# Altium schematic sheet BatteryStackMonitor.SchDoc: Battery stack monitor
size A3; SheetNumber: 2; SheetTotal: 7
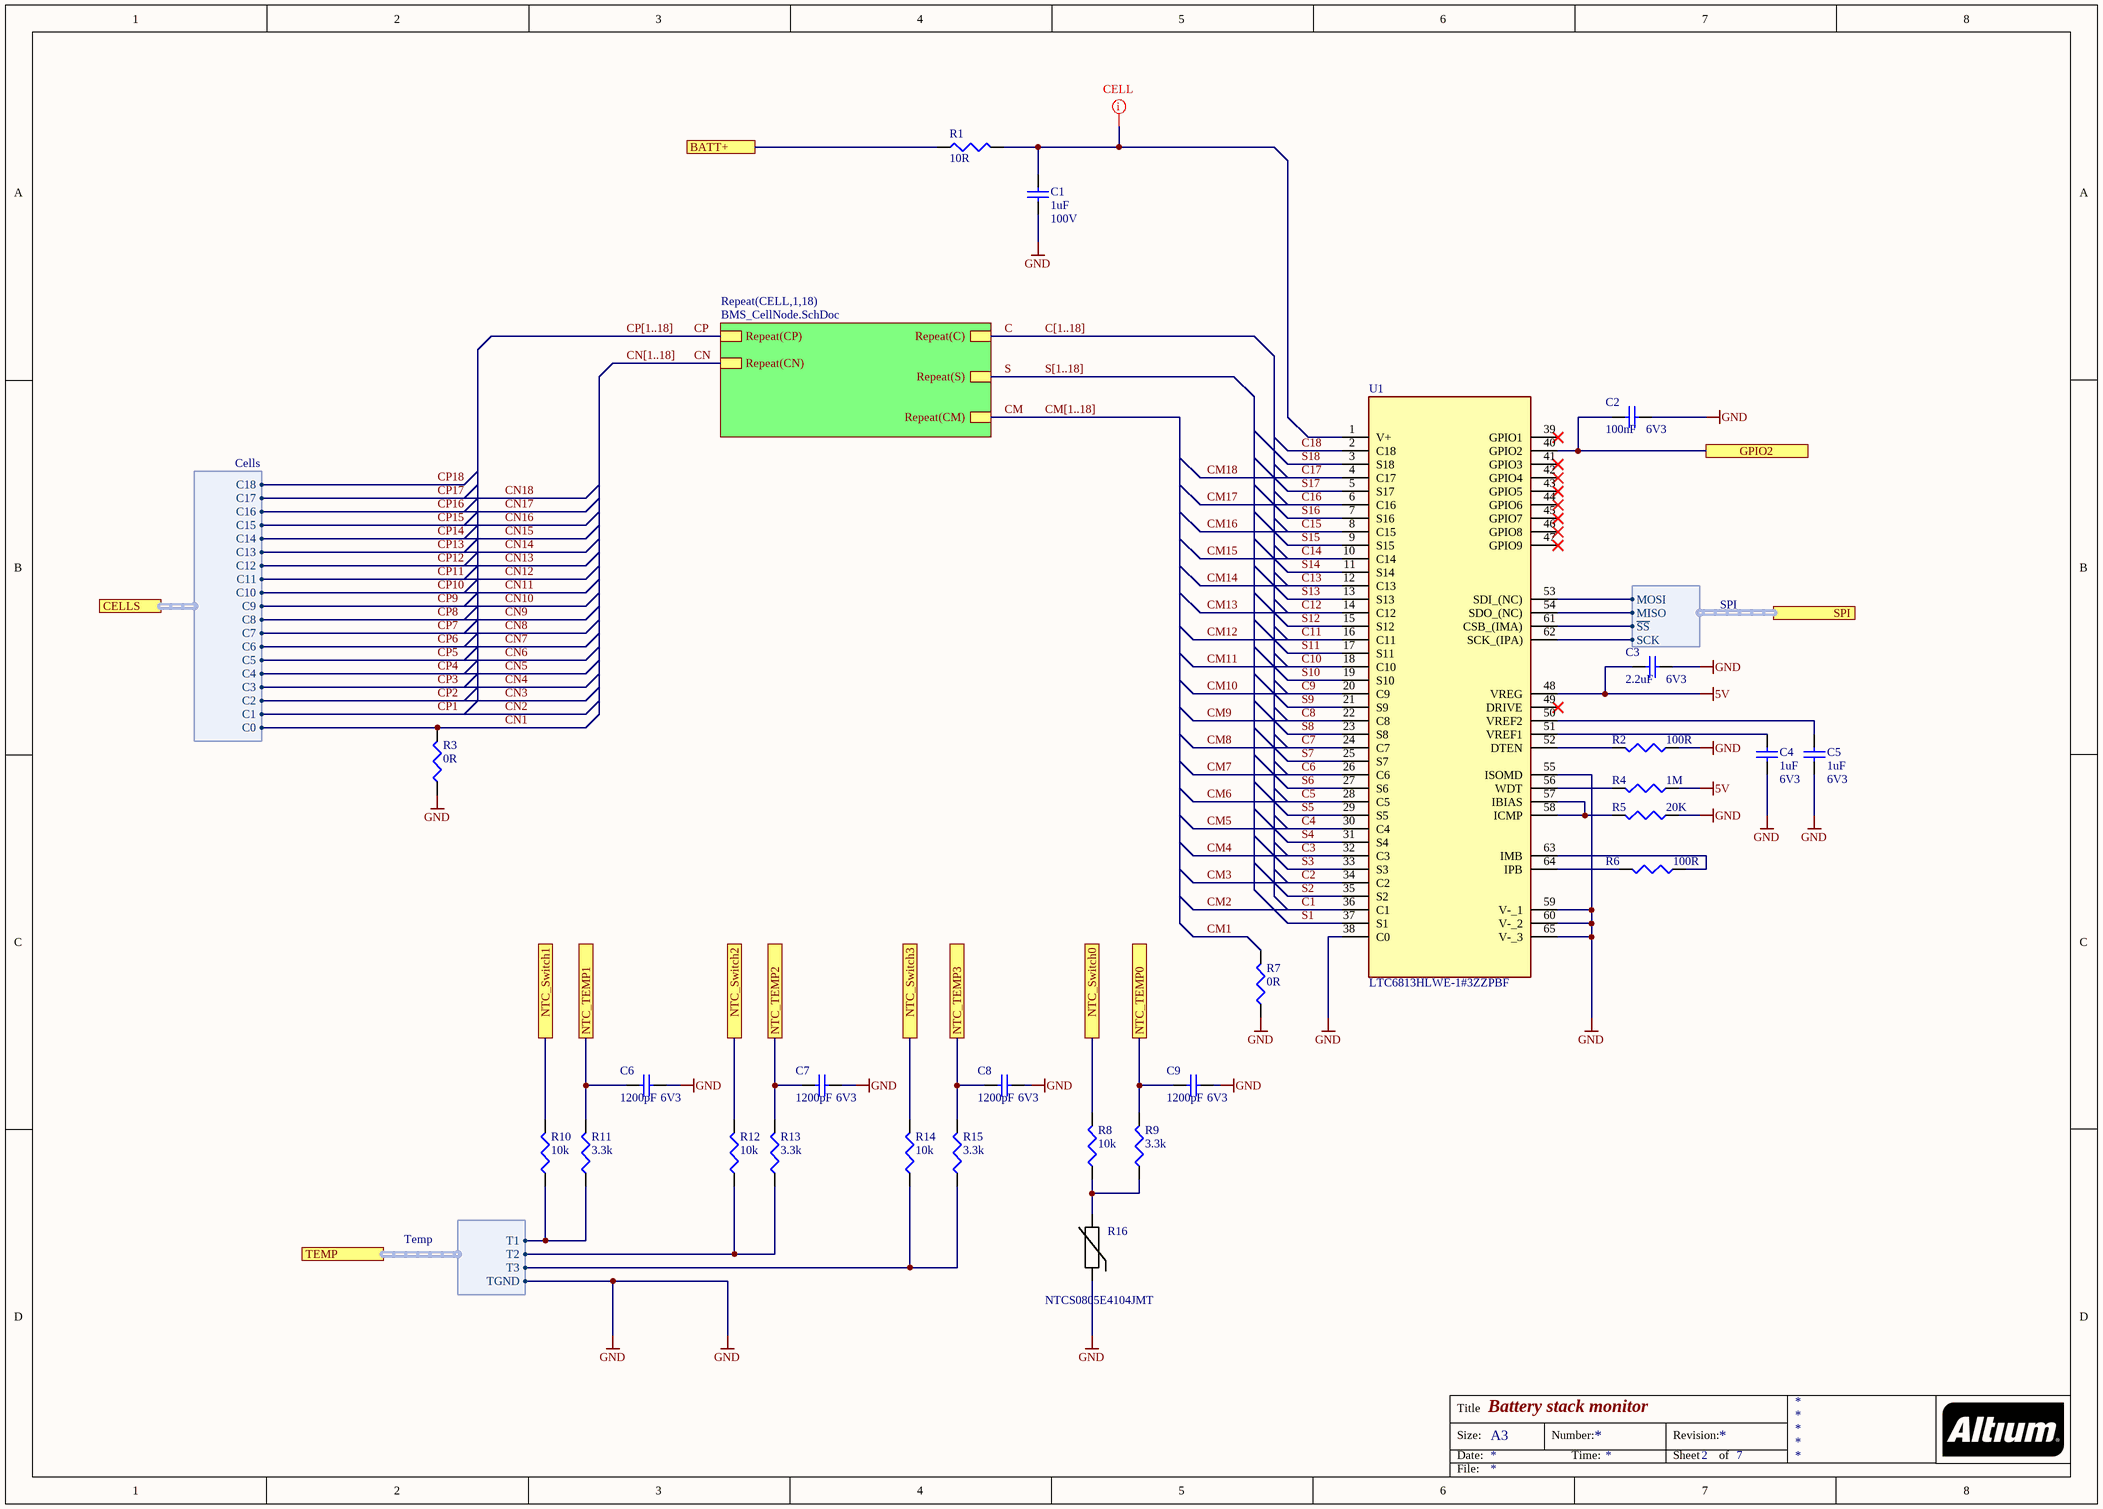
[diagram p0: BatteryStackMonitor.SchDoc]

## Parts
C1  1uF  Voltage Rating: 100V  [C-1206]
C2  100nF  Voltage Rating: 6V3  [C0402]
C3  2.2uF  Voltage Rating: 6V3  [C0402]
C4  1uF  Voltage Rating: 6V3  [C0402]
C5  1uF  Voltage Rating: 6V3  [C0402]
C6  1200pF  Voltage Rating: 6V3  [C0402]
C7  1200pF  Voltage Rating: 6V3  [C0402]
C8  1200pF  Voltage Rating: 6V3  [C0402]
C9  1200pF  Voltage Rating: 6V3  [C0402]
R1  10R  [R1206]
R2  100R  [0402]
R3  0R  [0603]
R4  1M  [0402]
R5  20K  [0402]
R6  100R  [0402]
R7  0R  [0603]
R8  10k  [0402]
R9  3.3k  [0402]
R10  10k  [0402]
R11  3.3k  [0402]
R12  10k  [0402]
R13  3.3k  [0402]
R14  10k  [0402]
R15  3.3k  [0402]
R16  NTCS0805E4104JMT  [0603]
U1  LTC6813HLWE-1#3ZZPBF  [QFP50P1200X1200X160-65N]

## Sub-sheets
Repeat(CELL,1,18) = BMS_CellNode.SchDoc: Repeat(CN), Repeat(CP), Repeat(S), Repeat(C), Repeat(CM)

## Ports
BATT+, CELLS (harness Cells), GPIO2, NTC_Switch0, NTC_Switch1, NTC_Switch2, NTC_Switch3, NTC_TEMP0, NTC_TEMP1, NTC_TEMP2, NTC_TEMP3, SPI (harness SPI), TEMP (harness Temp)

## Harnesses
SPI: ~{SS}, SCK, MISO, MOSI
Cells: C1, C9, C2, C3, C4, C5, C6, C7, C8, C10, C11, C0, C12, C13, C14, C15, C16, C17, C18
Temp: T1, T2, TGND, T3

## Nets
5V: C3.1 R4.1 U1.48(VREG)
GND: C1.1 C2.2 C3.2 C4.2 C5.2 C6.2 C7.2 C8.2 C9.2 R2.1 R3.1 R5.1 R7.1 R16.1 U1.38(C0) U1.55(ISOMD) U1.59(V-_1) U1.60(V-_2) U1.65(V-_3) ; port TEMP.TGND
BATT+: R1.1 ; port BATT+
C: sheet Repeat(CELL,1,18)/Repeat(C)
C1: U1.36(C1)  [also labelled CM2]
C2: U1.34(C2)  [also labelled CM3]
C3: U1.32(C3)  [also labelled CM4]
C4: U1.30(C4)  [also labelled CM5]
C5: U1.28(C5)  [also labelled CM6]
C6: U1.26(C6)  [also labelled CM7]
C7: U1.24(C7)  [also labelled CM8]
C8: U1.22(C8)  [also labelled CM9]
C9: U1.20(C9)  [also labelled CM10]
C10: U1.18(C10)  [also labelled CM11]
C11: U1.16(C11)  [also labelled CM12]
C12: U1.14(C12)  [also labelled CM13]
C13: U1.12(C13)  [also labelled CM14]
C14: U1.10(C14)  [also labelled CM15]
C15: U1.8(C15)  [also labelled CM16]
C16: U1.6(C16)  [also labelled CM17]
C17: U1.4(C17)  [also labelled CM18]
C18: U1.2(C18)
CM: sheet Repeat(CELL,1,18)/Repeat(CM)
CM1: R7.2
CN: sheet Repeat(CELL,1,18)/Repeat(CN)
CN1: R3.2 ; port CELLS.C0
CN2: port CELLS.C1  [also labelled CP1]
CN3: port CELLS.C2  [also labelled CP2]
CN4: port CELLS.C3  [also labelled CP3]
CN5: port CELLS.C4  [also labelled CP4]
CN6: port CELLS.C5  [also labelled CP5]
CN7: port CELLS.C6  [also labelled CP6]
CN8: port CELLS.C7  [also labelled CP7]
CN9: port CELLS.C8  [also labelled CP8]
CN10: port CELLS.C9  [also labelled CP9]
CN11: port CELLS.C10  [also labelled CP10]
CN12: port CELLS.C11  [also labelled CP11]
CN13: port CELLS.C12  [also labelled CP12]
CN14: port CELLS.C13  [also labelled CP13]
CN15: port CELLS.C14  [also labelled CP14]
CN16: port CELLS.C15  [also labelled CP15]
CN17: port CELLS.C16  [also labelled CP16]
CN18: port CELLS.C17  [also labelled CP17]
CP: sheet Repeat(CELL,1,18)/Repeat(CP)
CP18: port CELLS.C18
GPIO2: C2.1 U1.40(GPIO2) ; port GPIO2
NTC_Switch0: R8.2 ; port NTC_Switch0
NTC_Switch1: R10.2 ; port NTC_Switch1
NTC_Switch2: R12.2 ; port NTC_Switch2
NTC_Switch3: R14.2 ; port NTC_Switch3
NTC_TEMP0: C9.1 R9.2 ; port NTC_TEMP0
NTC_TEMP1: C6.1 R11.2 ; port NTC_TEMP1
NTC_TEMP2: C7.1 R13.2 ; port NTC_TEMP2
NTC_TEMP3: C8.1 R15.2 ; port NTC_TEMP3
S: sheet Repeat(CELL,1,18)/Repeat(S)
S1: U1.37(S1)
S2: U1.35(S2)
S3: U1.33(S3)
S4: U1.31(S4)
S5: U1.29(S5)
S6: U1.27(S6)
S7: U1.25(S7)
S8: U1.23(S8)
S9: U1.21(S9)
S10: U1.19(S10)
S11: U1.17(S11)
S12: U1.15(S12)
S13: U1.13(S13)
S14: U1.11(S14)
S15: U1.9(S15)
S16: U1.7(S16)
S17: U1.5(S17)
S18: U1.3(S18)
NetC1_2: C1.2 R1.2 U1.1(V+)
NetC4_1: C4.1 U1.51(VREF1)
NetC5_1: C5.1 U1.50(VREF2)
NetR2_2: R2.2 U1.52(DTEN)
NetR4_2: R4.2 U1.56(WDT)
NetR5_2: R5.2 U1.57(IBIAS) U1.58(ICMP)
NetR6_1: R6.1 U1.63(IMB)
NetR6_2: R6.2 U1.64(IPB)
NetR8_1: R8.1 R9.1 R16.2
NetR10_1: R10.1 R11.1 ; port TEMP.T1
NetR12_1: R12.1 R13.1 ; port TEMP.T2
NetR14_1: R14.1 R15.1 ; port TEMP.T3
NetU1_53: U1.53(SDI_(NC)) ; port SPI.MOSI
NetU1_54: U1.54(SDO_(NC)) ; port SPI.MISO
NetU1_61: U1.61(CSB_(IMA)) ; port SPI.~{SS}
NetU1_62: U1.62(SCK_(IPA)) ; port SPI.SCK

Not connected (* = marked no-connect by the designer): U1 39(GPIO1)* 41(GPIO3)* 42(GPIO4)* 43(GPIO5)* 44(GPIO6)* 45(GPIO7)* 46(GPIO8)* 47(GPIO9)* 49(DRIVE)*

## Buses and harness runs
bus C[1..18]
bus CM[1..18]
bus CN[1..18]
bus CP[1..18]
bus S[1..18]

## Layout directives
net class CELL: NetC1_2

## Notes on the sheet
- Title
- Size:
- Date:
- A3
- Number:
- Time:
- Revision:
- Sheet
- of
- File:

## Library data of the parts
C1 = 1uF/1206/CER/100V: Capacitor, 1uF, 100V, X7R; Capacitance Tolerance: ± 10%; Capacitor Case Style: 1206; Brand Number: 12061C105K4Z2A; Brand: AVX; Dielectric Characteristic: X7R; Capacitance: 1uF; Temperature Range: -55°C to +125°C; Price: 0,52; Order Code Supplier: 1833855; Supplier: Farnell
C2-C9 = 1uF/0402/CER/6.3V: Capacitor, 1uF, 6.3V, X5R; Capacitance Tolerance: ± 10%; Capacitor Case Style: 0402; Brand Number: 04026D105KAT2A; Brand: AVX; Dielectric Characteristic: X5R; Capacitance: 1uF; Temperature Range: -55°C to +85°C; Price: 0,0874; Order Code Supplier: 1327658; Supplier: Farnell
R1 = RQ73C2B10RBTDF: Resistor; Manufacturer_Name: TE Connectivity; Datasheet Link: https://www.te.com/commerce/DocumentDelivery/DDEController?Action=showdoc&DocId=Data+Sheet%7F1773270-2%7FB%7Fpdf%7FEnglish%7FENG_DS_1773270-2_B.pdf%7F2176383-1; Height: 0.65mm; Manufacturer_Part_Number: RQ73C2B10RBTDF
R2 R4-R6 = 1M/0402/0063W/50V: Resistor, 1M, 0.1%, 0.0625W, 50V, 100PPM, 0402; Brand: VISHAY DRALORIC; Brand Number: CRCW04021M00FKED; Power Rating: 0.063W; Case Style: 0402; Order Code Supplier: 2121984; Price: 0,0006; Resistance: 1M; Supplier: Farnell; Temperature Coefficient: ± 100PPM; Temperature Range: -55°C to +125°C; Voltage Rating: 50V
R3 R7 = 0/0603/0063W/50V: Resistor, 0R, 0.1%, 0.063W, 50V, 200PPM, 0603; Brand: VISHAY DRALORIC; Brand Number: CRCW06030000Z0EA; Case Style: 0603; Order Code Supplier: 2122112; Power Rating: 0.063W; Price: 0,043; Resistance: 0R; Supplier: Farnell; Temperature Coefficient: ± 200PPM; Temperature Range: -55°C to +125°C; Voltage Rating: 50V
R8-R15 = 10k/0402/0063W/50V: Resistor, 10k, 0.1%, 0.0625W, 50V, 100PPM, 0402; Brand: VISHAY DRALORIC; Brand Number: CRCW040210K0FKED; Power Rating: 0.063W; Case Style: 0402; Order Code Supplier: 2121730; Price: 0,0005; Resistance: 10k; Supplier: Farnell; Temperature Coefficient: ± 100PPM; Temperature Range: -55°C to +125°C; Voltage Rating: 50V
R16 = NTCS0805E4104JMT: THERMISTOR, NTC, 100K, 5%; Case Style: 0805; Brand: VISHAY; Supplier: Farnell; Price: 0,65; Order Code Supplier: 1187095; Brand Number: NTCS0805E4104JMT
U1 = LTC6813HLWE-1#3ZZPBF: Integrated Circuit; Manufacturer_Name: Analog Devices; Datasheet Link: https://www.analog.com/media/en/technical-documentation/data-sheets/LTC6813-1.pdf; Height: 1.6mm; Manufacturer_Part_Number: LTC6813HLWE-1#3ZZPBF; Mouser Part Number: 584-6813HLWE13ZZPBF; Mouser Price/Stock: https://www.mouser.co.uk/ProductDetail/Analog-Devices-Linear-Technology/LTC6813HLWE-13ZZPBF?qs=lYGu3FyN48e3Qu9IYnRGuQ%3D%3D; Arrow Part Number: LTC6813HLWE-1#3ZZPBF; Arrow Price/Stock: https://www.arrow.com/en/products/ltc6813hlwe-13zzpbf/linear-technology